# Altium project TP_IHM.PrjPCB
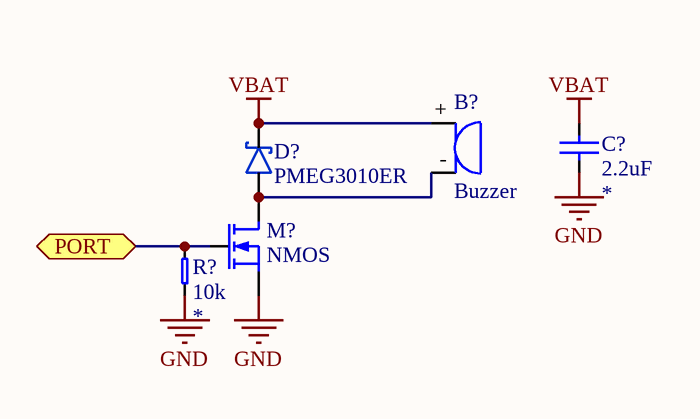
[diagram p0: TP_IHM_BUZZER.SchDoc]
6 sheets, 18 parts. Net scope: flat (ports and power ports of the same name join across sheets).
Sheets:
  TP_IHM_MAIN.SchDoc
  TP_IHM_BUZZER.SchDoc
  TP_IHM_7SEG.SchDoc
  TP_IHM_POWER.SchDoc
  TP_IHM_CONNECTOR.SchDoc
  TP_IHM_7SEG_DRIVERS.SchDoc

## Sheet TP_IHM_MAIN.SchDoc
size A4

## Sheet TP_IHM_BUZZER.SchDoc
size A4

### Parts
(Parts that share a designator on the sheet are numbered #1, #2 ... from top to bottom, then left to right.)
B?#1  Buzzer  [SD160709]
C?  value 2.2uF  [0603_CAP_LD]  (hidden comment: CerCap)
D?  PMEG3010ER  [SOD123W]
M?  NMOS  [MOSFET-SOT23]
R?#1  value 10k  [0603_RES_LD]  (hidden comment: Resistor)

### Ports
PORT

### Nets
GND: C?.1 M?.S R?#1.1
VBAT: B?#1.+ C?.2 D?.K
NetB?#1_-: B?#1.- D?.A M?.D
NetM?_G: M?.G R?#1.2 ; port PORT

### Library data of the parts
B?#1 = SD160709: TDK SD160709 Buzzer; Reference: SD160709
C? = CerCap: Ceramic Capacitor; Type: *; Voltage/Power: *; Package: *
D? = Schottky_PMEG3010ER: Nexperia 1A low Vf Mega Schottky barrier rectifier; Reference: PMEG3010ER
M? = N-MOSFET: N MOSFET
R?#1 = Resistor: Precision: *; Package: *

## Sheet TP_IHM_7SEG.SchDoc
size A4
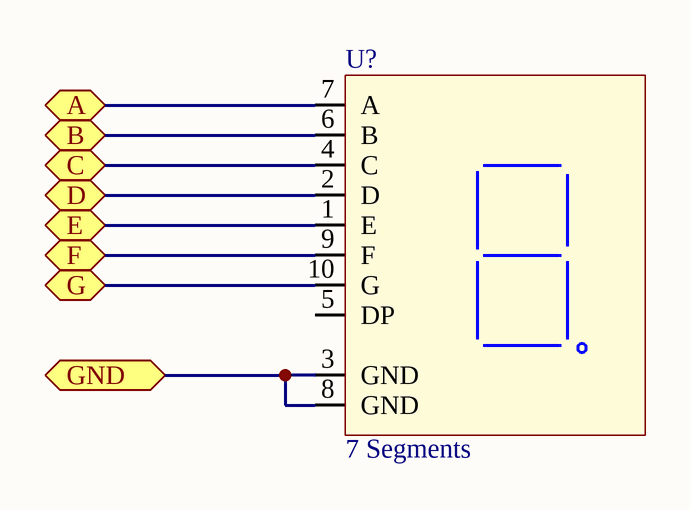
[diagram p1: TP_IHM_7SEG.SchDoc]

### Parts
U?  7 Segments  [SA10-21GWA]

### Ports
A, B, C, D, E, F, G, GND

### Nets
NetU?_1: U?.1(E) ; port E
NetU?_2: U?.2(D) ; port D
NetU?_3: U?.3(GND) U?.8(GND) ; port GND
NetU?_4: U?.4(C) ; port C
NetU?_6: U?.6(B) ; port B
NetU?_7: U?.7(A) ; port A
NetU?_9: U?.9(F) ; port F
NetU?_10: U?.10(G) ; port G

Not connected (* = marked no-connect by the designer): U? 5(DP)

### Library data of the parts
U? = SC10-21SRWA: KingBright Led 7 Segments; Reference: SC10-21SRWA

## Sheet TP_IHM_POWER.SchDoc
size A4
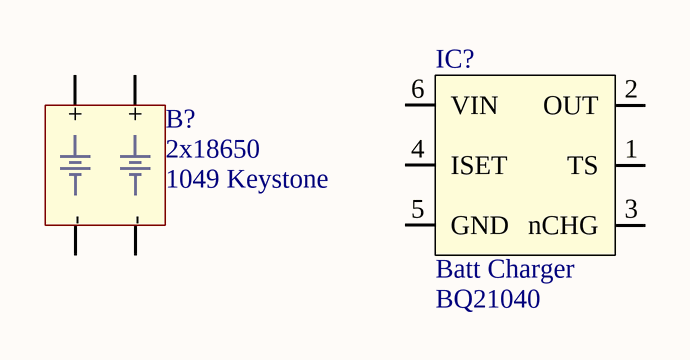
[diagram p2: TP_IHM_POWER.SchDoc]

### Parts
(Parts that share a designator on the sheet are numbered #1, #2 ... from top to bottom, then left to right.)
B?#2  2x18650  ref: 1049 Keystone  [KEYSTONE_1049_DUAL_18650_HOLDER]
IC?#1  Batt Charger  [BQ21040]

### Nets

Not connected (* = marked no-connect by the designer): B?#2 A+(+) A-(-) B+(+) B-(-); IC?#1 1(TS) 2(OUT) 3(nCHG) 4(ISET) 5(GND) 6(VIN)

### Library data of the parts
B?#2 = Dual_18650: Dual 18650 Holder
IC?#1 = BQ21040: Single Input Single Cell Li-ion/Pol Charger; chip: BQ21040

## Sheet TP_IHM_CONNECTOR.SchDoc
size A4
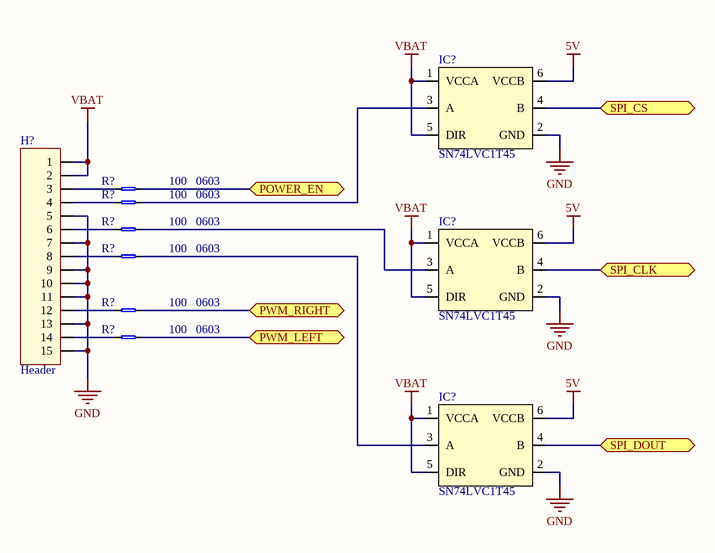
[diagram p3: TP_IHM_CONNECTOR.SchDoc]

### Parts
(Parts that share a designator on the sheet are numbered #1, #2 ... from top to bottom, then left to right.)
H?  Header  [653115131822]
IC?#2  SN74LVC1T45  [MO-203AB_LD]
IC?#3  SN74LVC1T45  [MO-203AB_LD]
IC?#4  SN74LVC1T45  [MO-203AB_LD]
R?#2  value 100  Package: 0603  [0603_RES_LD]  (hidden comment: Resistor)
R?#3  value 100  Package: 0603  [0603_RES_LD]  (hidden comment: Resistor)
R?#4  value 100  Package: 0603  [0603_RES_LD]  (hidden comment: Resistor)
R?#5  value 100  Package: 0603  [0603_RES_LD]  (hidden comment: Resistor)
R?#6  value 100  Package: 0603  [0603_RES_LD]  (hidden comment: Resistor)
R?#7  value 100  Package: 0603  [0603_RES_LD]  (hidden comment: Resistor)

### Ports
POWER_EN, PWM_LEFT, PWM_RIGHT, SPI_CLK, SPI_CS, SPI_DOUT

### Nets
5V: IC?#2.6(VCCB) IC?#3.6(VCCB) IC?#4.6(VCCB)
GND: H?.5 H?.7 H?.9 H?.10 H?.11 H?.13 H?.15 IC?#2.2(GND) IC?#3.2(GND) IC?#4.2(GND)
VBAT: H?.1 H?.2 IC?#2.1(VCCA) IC?#2.5(DIR) IC?#3.1(VCCA) IC?#3.5(DIR) IC?#4.1(VCCA) IC?#4.5(DIR)
NetH?_3: H?.3 R?#2.1
NetH?_4: H?.4 R?#3.1
NetH?_6: H?.6 R?#4.1
NetH?_8: H?.8 R?#5.1
NetH?_12: H?.12 R?#6.1
NetH?_14: H?.14 R?#7.1
NetIC?#2_3: IC?#2.3(A) R?#3.2
NetIC?#2_4: IC?#2.4(B) ; port SPI_CS
NetIC?#3_3: IC?#3.3(A) R?#4.2
NetIC?#3_4: IC?#3.4(B) ; port SPI_CLK
NetIC?#4_3: IC?#4.3(A) R?#5.2
NetIC?#4_4: IC?#4.4(B) ; port SPI_DOUT
NetR?#2_2: R?#2.2 ; port POWER_EN
NetR?#6_2: R?#6.2 ; port PWM_RIGHT
NetR?#7_2: R?#7.2 ; port PWM_LEFT

### Library data of the parts
H? = HEADER_15x1: Header 15x1
IC?#2-IC?#4 = SN74LVC1T45: Single Bit Dual Supply Buffer
R?#2-R?#7 = Resistor: Precision: *

## Sheet TP_IHM_7SEG_DRIVERS.SchDoc
size A4

## Nets that join several sheets
GND: TP_IHM_BUZZER (C?.1 M?.S R?#1.1), TP_IHM_CONNECTOR (10 pins)
VBAT: TP_IHM_BUZZER (B?#1.+ C?.2 D?.K), TP_IHM_CONNECTOR (8 pins)